# EAGLE design H05 (EAGLE 6.6.0)

## Sheet 1 of 3
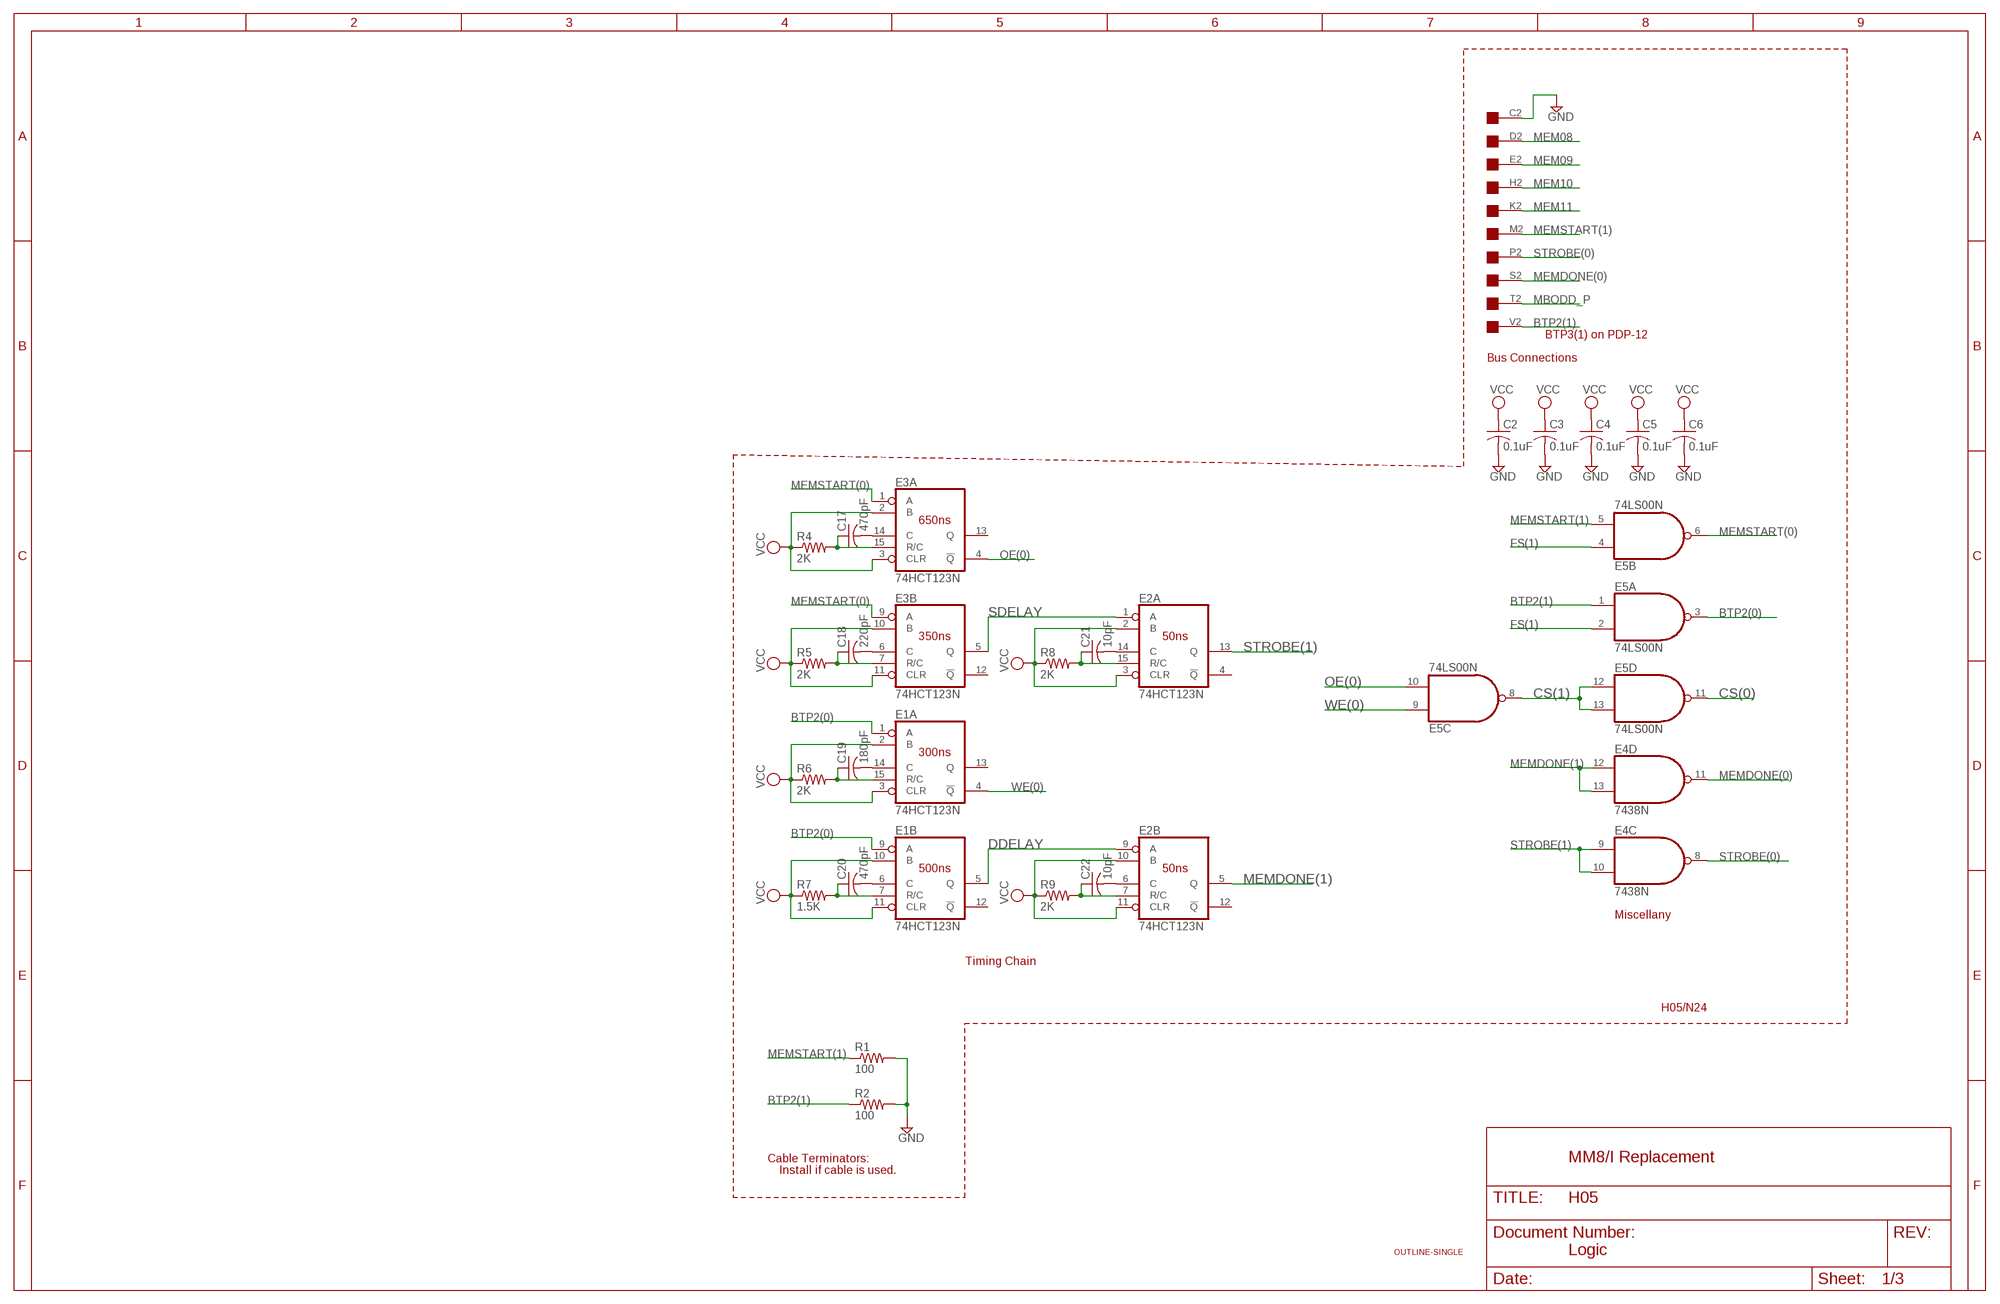
[diagram p0: schematic, sheet 1]

### Parts
C2  0.1uF  C-US050-025X075  [C050-025X075]
C3  0.1uF  C-US050-025X075  [C050-025X075]
C4  0.1uF  C-US050-025X075  [C050-025X075]
C5  0.1uF  C-US050-025X075  [C050-025X075]
C6  0.1uF  C-US050-025X075  [C050-025X075]
C17  470pF  C-US050-025X075  [C050-025X075]
C18  220pF  C-US050-025X075  [C050-025X075]
C19  180pF  C-US050-025X075  [C050-025X075]
C20  470pF  C-US050-025X075  [C050-025X075]
C21  10pF  C-US050-025X075  [C050-025X075]
C22  10pF  C-US050-025X075  [C050-025X075]
E1  74HCT123N  74LS123N  [DIL16]
E2  74HCT123N  74LS123N  [DIL16]
E3  74HCT123N  74LS123N  [DIL16]
E4  7438N  74LS38N  [DIL14]
E5  74LS00N  [DIL14]
H05  EDGE-1  [EDGE-CON1]
R1  100  R-US_0207/10  [0207/10]
R2  100  R-US_0207/10  [0207/10]
R4  2K  R-US_0207/10  [0207/10]
R5  2K  R-US_0207/10  [0207/10]
R6  2K  R-US_0207/10  [0207/10]
R7  1.5K  R-US_0207/10  [0207/10]
R8  2K  R-US_0207/10  [0207/10]
R9  2K  R-US_0207/10  [0207/10]
U$1  OUTLINE-SINGLE  [SINGLE]

### Nets
BTP2(0): E1.1(A:A) E1.9(B:A) E5.3(A:O)
BTP2(1): E5.1(A:I0) H05.V2 R2.1
CS(0): E5.11(D:O) ; also sheet 2
CS(1): E5.8(C:O) E5.12(D:I0) E5.13(D:I1)
DDELAY: E1.5(B:Q) E2.9(B:A)
FS(1): E5.2(A:I1) E5.4(B:I0) ; also sheet 2
GND [supply]: C2.2 C3.2 C4.2 C5.2 C6.2 H05.C2 R1.2 R2.2 ; also sheet 2
MBODD_P: H05.T2 ; also sheet 2
MEM08: H05.D2 ; also sheet 2
MEM09: H05.E2 ; also sheet 2
MEM10: H05.H2 ; also sheet 2
MEM11: H05.K2 ; also sheet 2
MEMDONE(0): E4.11(D:O) H05.S2
MEMDONE(1): E2.5(B:Q) E4.12(D:I0) E4.13(D:I1)
MEMSTART(0): E3.1(A:A) E3.9(B:A) E5.6(B:O)
MEMSTART(1): E5.5(B:I1) H05.M2 R1.1
N$5: C17.1 E3.15(A:R/C) R4.2
N$6: C17.2 E3.14(A:C)
N$7: C18.1 E3.7(B:R/C) R5.2
N$8: C18.2 E3.6(B:C)
N$9: C19.1 E1.15(A:R/C) R6.2
N$10: C19.2 E1.14(A:C)
N$11: C20.1 E1.7(B:R/C) R7.2
N$12: C20.2 E1.6(B:C)
N$13: C21.1 E2.15(A:R/C) R8.2
N$14: C21.2 E2.14(A:C)
N$15: C22.1 E2.7(B:R/C) R9.2
N$16: C22.2 E2.6(B:C)
OE(0): E3.4(A:!Q) E5.10(C:I1) ; also sheet 2
SDELAY: E2.1(A:A) E3.5(B:Q)
STROBE(0): E4.8(C:O) H05.P2
STROBE(1): E2.13(A:Q) E4.9(C:I0) E4.10(C:I1)
VCC [supply]: C2.1 C3.1 C4.1 C5.1 C6.1 E1.2(A:B) E1.3(A:CLR) E1.10(B:B) E1.11(B:CLR) E2.2(A:B) E2.3(A:CLR) E2.10(B:B) E2.11(B:CLR) E3.2(A:B) E3.3(A:CLR) E3.10(B:B) E3.11(B:CLR) R4.1 R5.1 R6.1 R7.1 R8.1 R9.1 ; also sheet 2
WE(0): E1.4(A:!Q) E5.9(C:I0) ; also sheet 2
Unconnected: E1.12(B:!Q) E1.13(A:Q) E2.4(A:!Q) E2.12(B:!Q) E3.12(B:!Q) E3.13(A:Q) H05.A2 H05.B2 H05.F2 H05.J2 H05.L2 H05.N2 H05.R2 H05.U2

### Notes on the sheet
- BTP3(1) on PDP-12
- Bus Connections
- 650ns
- 350ns | 50ns
- 300ns
- 500ns | 50ns
- Miscellany
- Timing Chain
- H05/N24
- Cable Terminators: | MM8/I Replacement
- Install if cable is used.
- Logic

## Sheet 2 of 3
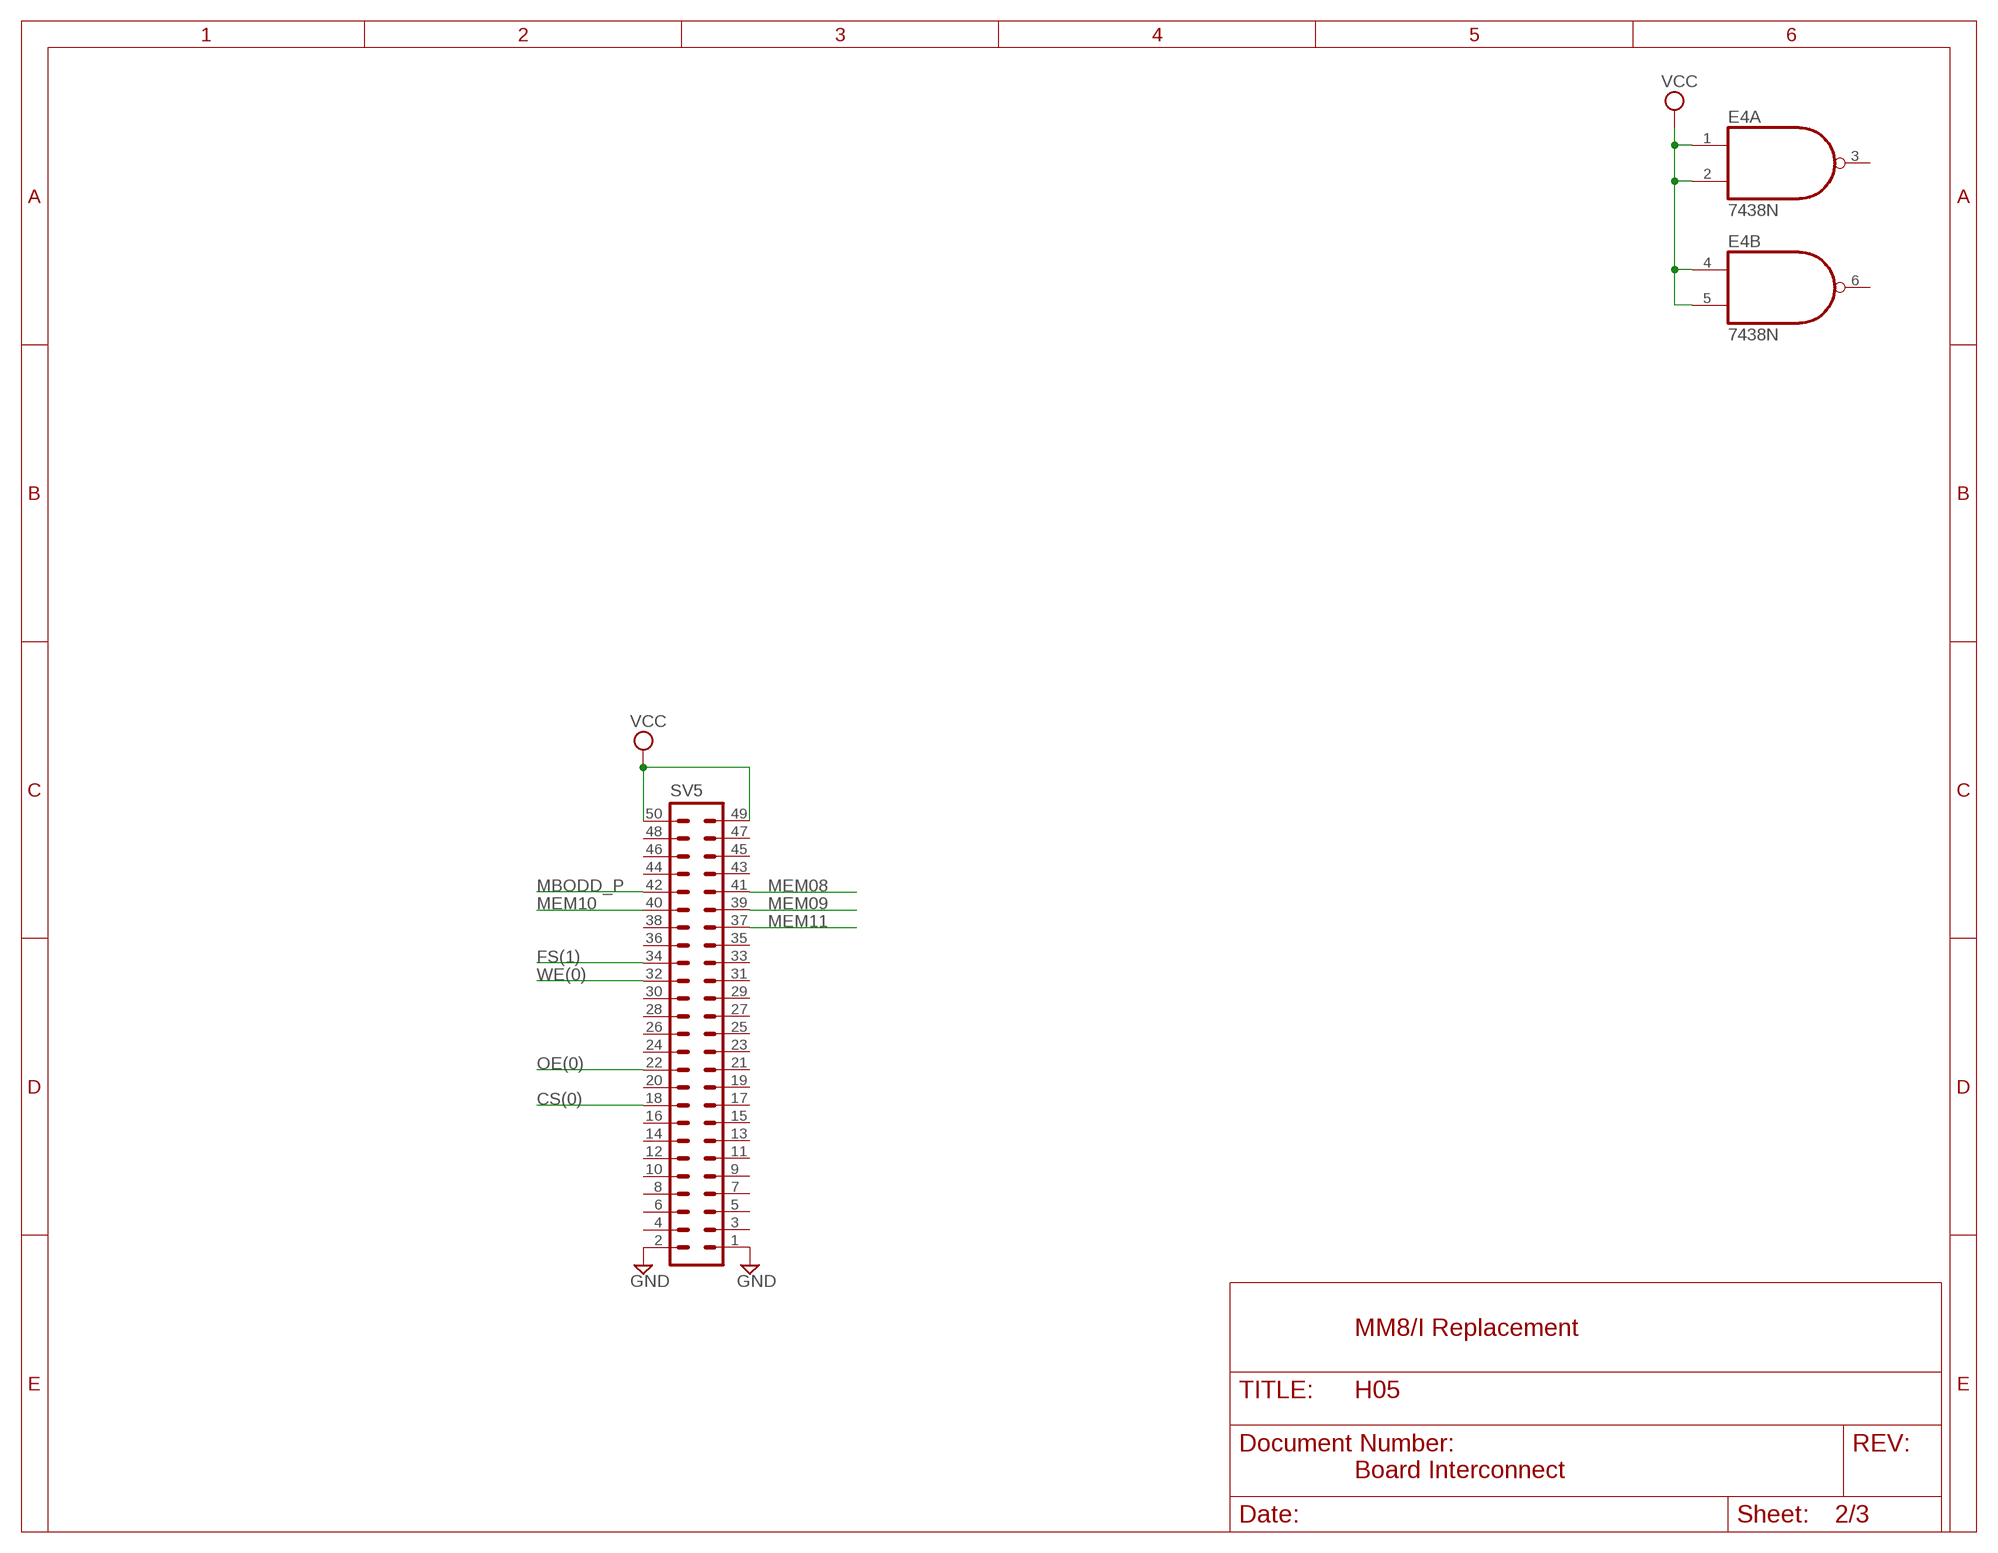
[diagram p1: schematic, sheet 2]

### Parts
SV5  ML50L  [ML50L]

### Nets
CS(0): SV5.18 ; also sheet 1
FS(1): SV5.34 ; also sheet 1
GND [supply]: SV5.1 SV5.2 ; also sheet 1
MBODD_P: SV5.42 ; also sheet 1
MEM08: SV5.41 ; also sheet 1
MEM09: SV5.39 ; also sheet 1
MEM10: SV5.40 ; also sheet 1
MEM11: SV5.37 ; also sheet 1
OE(0): SV5.22 ; also sheet 1
VCC [supply]: E4.1(A:I0) E4.2(A:I1) E4.4(B:I0) E4.5(B:I1) SV5.49 SV5.50 ; also sheet 1
WE(0): SV5.32 ; also sheet 1
Unconnected: E4.3(A:O) E4.6(B:O) SV5.3 SV5.4 SV5.5 SV5.6 SV5.7 SV5.8 SV5.9 SV5.10 SV5.11 SV5.12 SV5.13 SV5.14 SV5.15 SV5.16 SV5.17 SV5.19 SV5.20 SV5.21 SV5.23 SV5.24 SV5.25 SV5.26 SV5.27 SV5.28 SV5.29 SV5.30 SV5.31 SV5.33 SV5.35 SV5.36 SV5.38 SV5.43 SV5.44 SV5.45 SV5.46 SV5.47 SV5.48

### Notes on the sheet
- MM8/I Replacement
- Board Interconnect

## Sheet 3 of 3
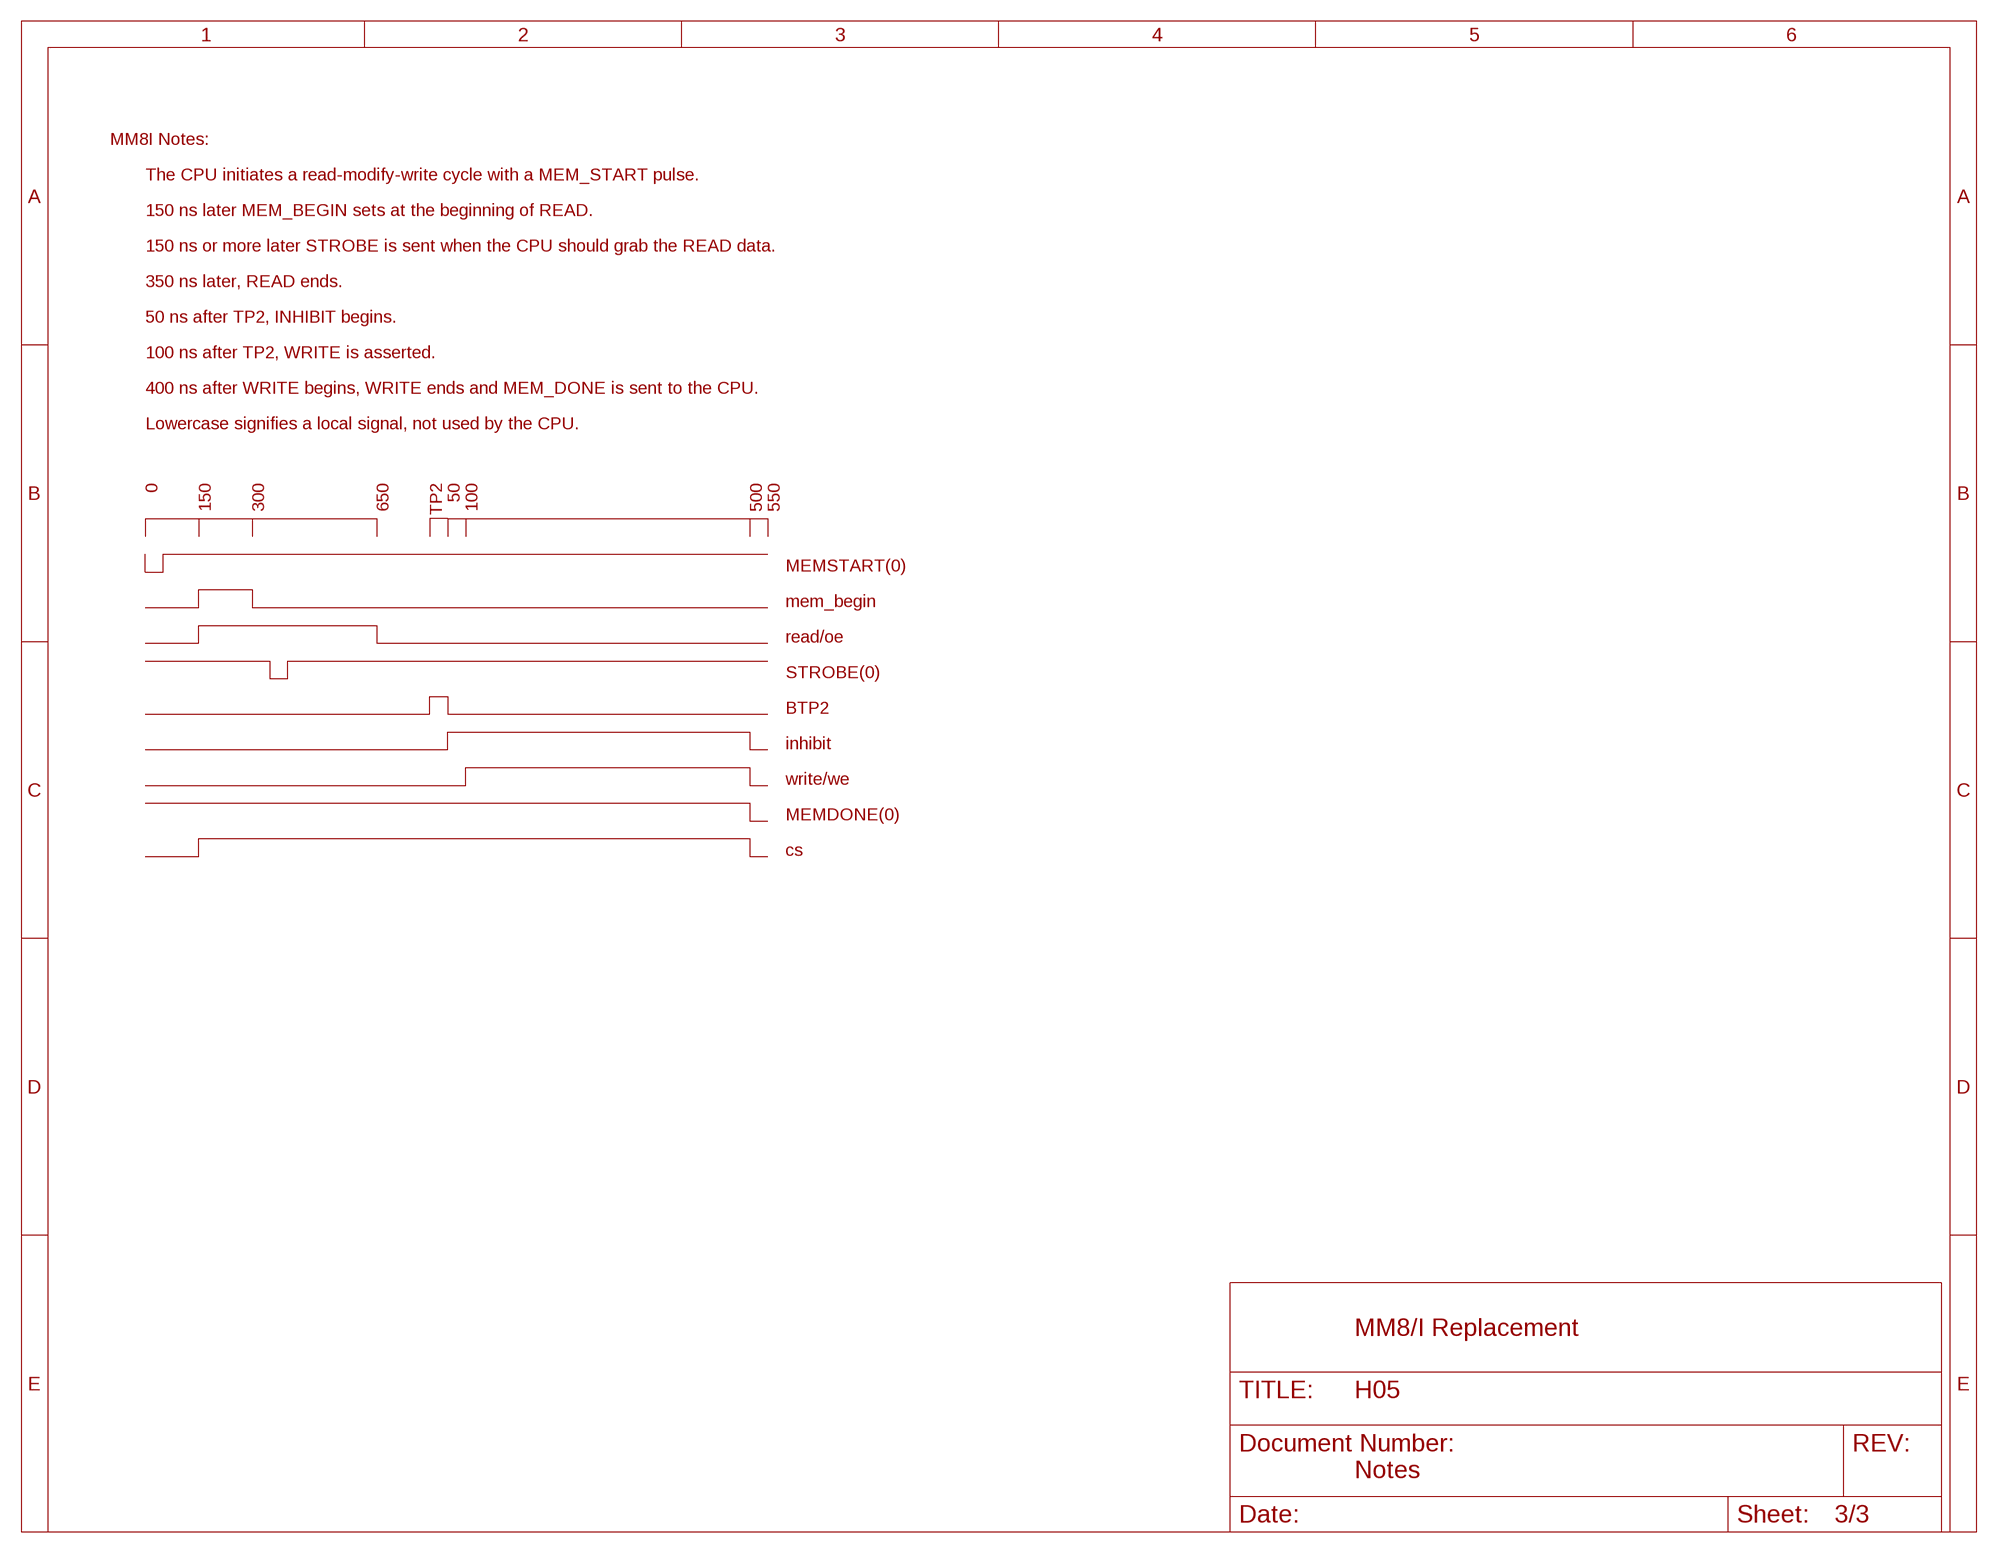
[diagram p2: schematic, sheet 3]

### Notes on the sheet
- MM8I Notes:
- The CPU initiates a read-modify-write cycle with a MEM_START pulse.
- 150 ns later MEM_BEGIN sets at the beginning of READ.
- 150 ns or more later STROBE is sent when the CPU should grab the READ data.
- 350 ns later, READ ends.
- 50 ns after TP2, INHIBIT begins.
- 100 ns after TP2, WRITE is asserted.
- 400 ns after WRITE begins, WRITE ends and MEM_DONE is sent to the CPU.
- Lowercase signifies a local signal, not used by the CPU.
- 0 | 150 | 300 | 650 | TP2 | 50 | 100 | 500 | 550
- MEMSTART(0)
- mem_begin
- read/oe
- STROBE(0)
- BTP2
- inhibit
- write/we
- MEMDONE(0)
- cs
- MM8/I Replacement
- Notes

## Power pins joined to a net without a drawn wire
GND: E1.8(P:GND) E2.8(P:GND) E3.8(P:GND) E4.7(P:GND) E5.7(P:GND)
VCC: E1.16(P:VCC) E2.16(P:VCC) E3.16(P:VCC) E4.14(P:VCC) E5.14(P:VCC)

## Library data of the parts
C2-C6 C17-C22 = rcl:C-US: CAPACITOR, American symbol
E1-E3 = 74xx-us:74*123: Retriggerable monostable MULTIVIBRATOR
E4 = dec-con:74*38: Quad 2-input NAND gate, open collector output
E5 = 74xx-us:74*00: Quad 2-input NAND gate
H05 = dec-con:EDGE-1: Single-Sided DEC Edge Connector -- (side 2)
R1 R2 R4-R9 = rcl:R-US_: RESISTOR, American symbol
SV5 = con-ml:ML50L: HARTING; OC_FARNELL: unknown; OC_NEWARK: unknown
U$1 = dec-con:OUTLINE-*: Board outlines for DEC boards.

## Net classes
1 supply: width 0.711 mm

## Board
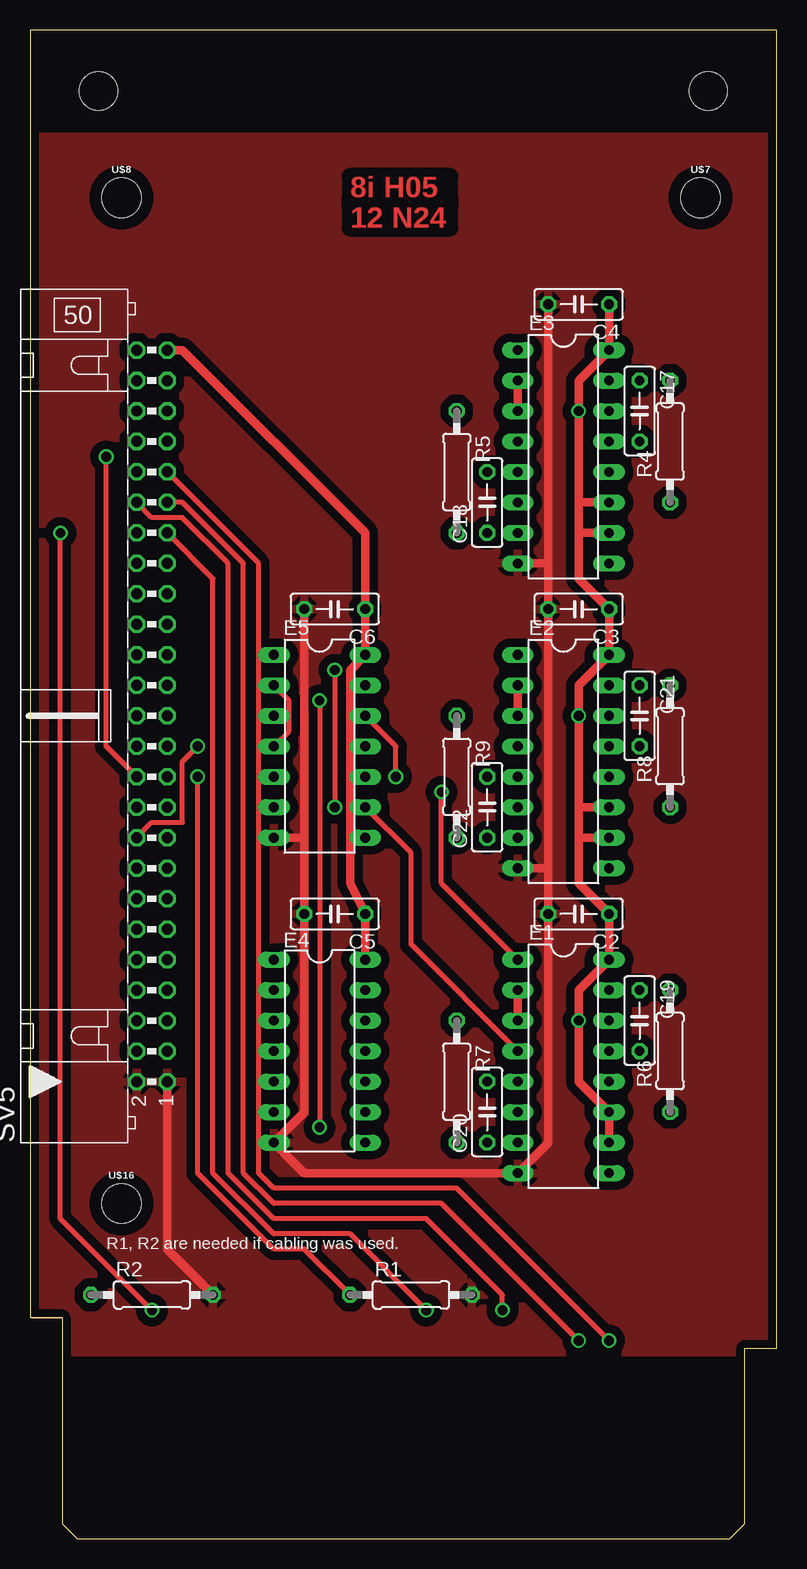
[diagram p3: board, top side]
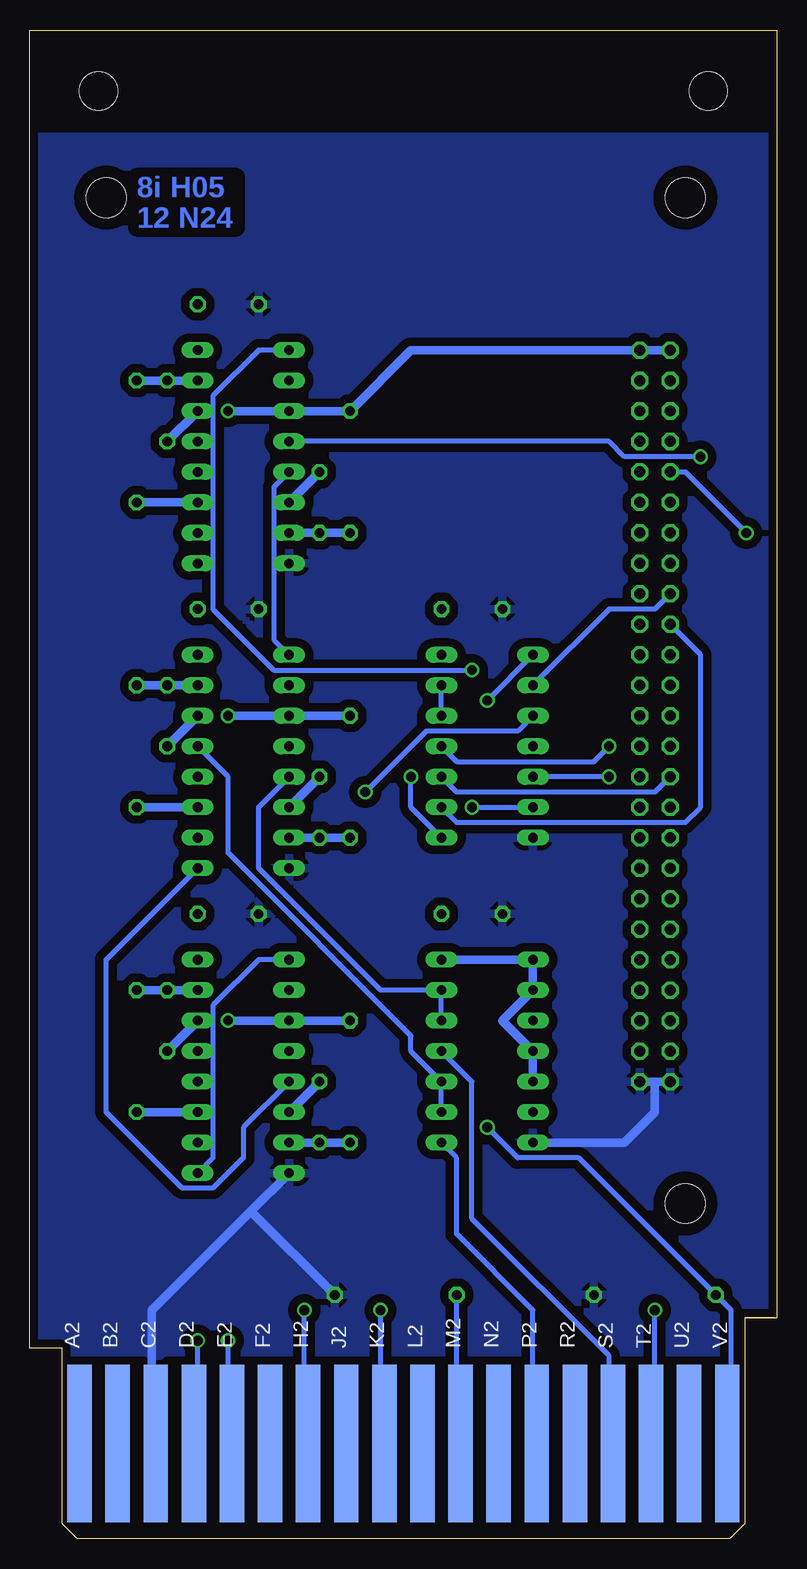
[diagram p4: board, bottom side, seen from below]

Size 62.23 x 125.73 mm. Coordinates in mm from the lower left corner, seen from the top.
Copper layers (1+16): Top 0.035mm / dielectric 1.5mm / Bottom 0.035mm
Design rules "16mils *": minimum track width 16mil, minimum drill 32mil, track to track 15mil, track to pad 10mil, pad to pad 10mil, via to via 10mil, smd to smd 10mil, copper to edge 13mil, drill to drill 10mil, minimum pad ring 10mil, minimum via ring 8mil, stop-mask expansion 0mil, vias tented up to drill 0mil, thermal gap 16mil

### Footprints (pad centres in the part's own frame; a part is rotated, then mirrored left to right if it is on the bottom)
C050-025X075 = drill 0.813 octagon: 1 -2.54,0; 2 2.54,0
DIL16 = drill 0.813 long: 1 -8.89,-3.81; 2 -6.35,-3.81; 3 -3.81,-3.81; 4 -1.27,-3.81; 5 1.27,-3.81; 6 3.81,-3.81; 7 6.35,-3.81; 8 8.89,-3.81; 9 8.89,3.81; 10 6.35,3.81; 11 3.81,3.81; 12 1.27,3.81; 13 -1.27,3.81; 14 -3.81,3.81; 15 -6.35,3.81; 16 -8.89,3.81
DIL14 = drill 0.813 long: 1 -7.62,-3.81; 2 -5.08,-3.81; 3 -2.54,-3.81; 4 0,-3.81; 5 2.54,-3.81; 6 5.08,-3.81; 7 7.62,-3.81; 8 7.62,3.81; 9 5.08,3.81; 10 2.54,3.81; 11 0,3.81; 12 -2.54,3.81; 13 -5.08,3.81; 14 -7.62,3.81
EDGE-CON1 = smd 13.106 x 2.032 bottom: A2 7.938,4.128; B2 7.938,7.303; C2 7.938,10.477; D2 7.938,13.652; E2 7.938,16.828; F2 7.938,20.003; H2 7.938,23.177; J2 7.938,26.352; K2 7.938,29.527; L2 7.938,32.703; M2 7.938,35.877; N2 7.938,39.053; P2 7.938,42.227; R2 7.938,45.403; S2 7.938,48.578; T2 7.938,51.752; U2 7.938,54.928; V2 7.938,58.102
0207/10 = drill 0.813 octagon: 1 -5.08,0; 2 5.08,0
ML50L = drill 0.914 octagon: 1 -30.48,-1.27; 2 -30.48,1.27; 3 -27.94,-1.27; 4 -27.94,1.27; 5 -25.4,-1.27; 6 -25.4,1.27; 7 -22.86,-1.27; 8 -22.86,1.27; 9 -20.32,-1.27; 10 -20.32,1.27; 11 -17.78,-1.27; 12 -17.78,1.27; 13 -15.24,-1.27; 14 -15.24,1.27; 15 -12.7,-1.27; 16 -12.7,1.27; 17 -10.16,-1.27; 18 -10.16,1.27; 19 -7.62,-1.27; 20 -7.62,1.27; 21 -5.08,-1.27; 22 -5.08,1.27; 23 -2.54,-1.27; 24 -2.54,1.27; 25 0,-1.27; 26 0,1.27; 27 2.54,-1.27; 28 2.54,1.27; 29 5.08,-1.27; 30 5.08,1.27; 31 7.62,-1.27; 32 7.62,1.27; 33 10.16,-1.27; 34 10.16,1.27; 35 12.7,-1.27; 36 12.7,1.27; 37 15.24,-1.27; 38 15.24,1.27; 39 17.78,-1.27; 40 17.78,1.27; 41 20.32,-1.27; 42 20.32,1.27; 43 22.86,-1.27; 44 22.86,1.27; 45 25.4,-1.27; 46 25.4,1.27; 47 27.94,-1.27; 48 27.94,1.27; 49 30.48,-1.27; 50 30.48,1.27
SINGLE = hole 3.175: 120.65,56.515; 120.65,5.715
STAND-OFF = hole 3.302: 0,0

### Placement (x,y rotation side)
C2  45.72,52.07 180 top
C3  45.72,77.47 180 top
C4  45.72,102.87 180 top
C5  25.4,52.07 180 top
C6  25.4,77.47 180 top
C17  50.8,93.98 270 top
C18  38.1,86.36 90 top
C19  50.8,43.18 270 top
C20  38.1,35.56 90 top
C21  50.8,68.58 270 top
C22  38.1,60.96 90 top
E1  44.45,39.37 270 top
E2  44.45,64.77 270 top
E3  44.45,90.17 270 top
E4  24.13,40.64 270 top
E5  24.13,66.04 270 top
H05  62.23,0 90 top
R1  31.75,20.32 0 top
R2  10.16,20.32 0 top
R4  53.34,91.44 90 top
R5  35.56,88.9 270 top
R6  53.34,40.64 90 top
R7  35.56,38.1 270 top
R8  53.34,66.04 90 top
R9  35.56,63.5 270 top
SV5  10.16,68.58 90 top
U$1  62.23,0 90 top
U$7  [STAND-OFF]  55.88,111.76 0 top
U$8  [STAND-OFF]  7.62,111.76 0 top
U$16  [STAND-OFF]  7.62,27.94 0 top

### Tracks (layer width: path | path; a pad name or v marks a point on that pad's centre or on a via)
BTP2(0)  (via drill 0.81)
  Top 0.406: v34.29,62.23 34.29,54.61 E1.1
  Bottom 0.406: E5.3 21.59,67.31 29.21,67.31 v34.29,62.23 | E1.1 43.18,48.26 46.99,44.45 46.99,31.75 E1.9
BTP2(1)  (via drill 0.81)
  Top 0.406: v24.13,69.85 v24.13,34.29
  Bottom 0.406: H05.V2 4.13,8.57 3.81,8.89 3.81,19.05 R2.1 16.51,31.75 21.59,31.75 v24.13,34.29 | E5.1 v24.13,69.85
CS(0)  (via drill 0.81)
  Top 0.406: SV5.18 10.16,59.69 12.7,59.69 12.7,64.77 v13.97,66.04
  Bottom 0.406: E5.11 26.67,64.77 15.24,64.77 v13.97,66.04
CS(1)  (via drill 0.81)
  Top 0.406: v30.48,63.5 30.48,66.04 E5.12
  Bottom 0.406: E5.8 30.48,60.96 v30.48,63.5 | E5.12 E5.13
DDELAY
  Bottom 0.406: E1.5 44.45,34.29 44.45,31.75 46.99,29.21 49.53,29.21 55.88,35.56 55.88,48.26 E2.9
FS(1)
  Top 0.406: E5.4 21.59,67.31 21.59,69.85 E5.2
  Bottom 0.406: SV5.34 10.16,77.47 13.97,77.47 E5.2
GND
  Top 0.711: E5.7 22.86,58.42 | 22.86,58.42 C5.2 22.86,35.56 E4.7 22.86,30.48 E1.8 43.18,33.02 C2.2 43.18,55.88 | C6.2 22.86,58.42 | R2.2 11.43,24.13 SV5.1 | 43.18,55.88 C3.2 43.18,81.28 | 43.18,81.28 C4.2 | E2.8 43.18,55.88 | E3.8 43.18,81.28
  Bottom 0.711: H05.C2 51.75,8.57 52.07,8.89 52.07,19.05 43.81,27.31 | SV5.2 10.16,38.1 | SV5.1 10.16,38.1 | 10.16,38.1 10.16,35.56 12.7,33.02 E4.7 | E1.8 43.81,27.31 | R1.2 43.81,27.31
  pour Bottom (isolate 0.711): 0,15.24 62.23,15.24 62.23,116.84 0,116.84
  pour Top (isolate 0.711): 0,15.24 62.23,15.24 62.23,116.84 0,116.84
MBODD_P  (via drill 0.81)
  Top 0.406: v2.54,83.82 2.54,26.67 v10.16,19.05
  Bottom 0.406: H05.T2 10.48,8.57 10.16,8.89 v10.16,19.05 | SV5.42 7.62,88.9 v2.54,83.82
MEM08  (via drill 0.81)
  Top 0.406: SV5.41 19.05,81.28 19.05,30.48 20.32,29.21 35.56,29.21 v48.26,16.51
  Bottom 0.406: H05.D2 48.58,8.57 48.26,8.89 v48.26,16.51
MEM09  (via drill 0.81)
  Top 0.406: SV5.39 12.7,86.36 17.78,81.28 17.78,30.48 20.32,27.94 34.29,27.94 v45.72,16.51
  Bottom 0.406: H05.E2 45.4,8.57 45.72,8.89 v45.72,16.51
MEM10  (via drill 0.81)
  Top 0.406: SV5.40 10.16,85.09 12.7,85.09 16.51,81.28 16.51,30.48 20.32,26.67 33.02,26.67 39.37,20.32 v39.37,19.05
  Bottom 0.406: H05.H2 39.05,8.57 39.37,8.89 v39.37,19.05
MEM11  (via drill 0.81)
  Top 0.406: SV5.37 15.24,80.01 15.24,30.48 20.32,25.4 26.67,25.4 v33.02,19.05
  Bottom 0.406: H05.K2 32.7,8.57 33.02,8.89 v33.02,19.05
MEMDONE(0)
  Bottom 0.406: H05.S2 13.65,8.57 13.97,8.89 13.97,15.24 25.4,26.67 25.4,38.1 E4.11
MEMDONE(1)
  Bottom 0.406: E4.12 E4.13 33.02,45.72 43.18,55.88 43.18,60.96 E2.5
MEMSTART(0)  (via drill 0.81)
  Top 0.406: v25.4,72.39 v25.4,60.96
  Bottom 0.406: E3.1 43.18,99.06 46.99,95.25 46.99,81.28 | 46.99,81.28 E3.9 | 46.99,81.28 46.99,77.47 41.91,72.39 v25.4,72.39 | v25.4,60.96 E5.6
MEMSTART(1)  (via drill 0.81)
  Top 0.406: R1.1 22.86,24.13 20.32,24.13 13.97,30.48 v13.97,63.5
  Bottom 0.406: H05.M2 26.35,8.57 26.67,8.89 R1.1 | v13.97,63.5 E5.5
N$5
  Bottom 0.711: E3.15 C17.1 R4.2
N$6
  Bottom 0.711: E3.14 C17.2
N$7
  Bottom 0.711: R5.2 C18.1 E3.7
N$8
  Bottom 0.711: C18.2 E3.6
N$9
  Bottom 0.711: E1.15 C19.1 R6.2
N$10
  Bottom 0.711: C19.2 E1.14
N$11
  Bottom 0.711: E1.7 C20.1 R7.2
N$12
  Bottom 0.711: C20.2 E1.6
N$13
  Bottom 0.711: E2.15 C21.1 R8.2
N$14
  Bottom 0.711: E2.14 C21.2
N$15
  Bottom 0.711: E2.7 C22.1 R9.2
N$16
  Bottom 0.711: C22.2 E2.6
OE(0)  (via drill 0.81)
  Top 0.406: SV5.22 6.35,66.04 v6.35,90.17
  Bottom 0.406: v6.35,90.17 12.7,90.17 13.97,91.44 E3.4 | SV5.22 10.16,62.23 26.67,62.23 E5.10
SDELAY
  Bottom 0.406: E3.5 41.91,87.63 41.91,74.93 E2.1
STROBE(0)
  Bottom 0.406: H05.P2 20.32,8.26 20.32,19.05 26.67,25.4 26.67,31.75 E4.8
STROBE(1)
  Bottom 0.406: E4.9 E4.10 30.48,40.64 30.48,41.91 45.72,57.15 45.72,63.5 E2.13
VCC  (via drill 0.81)
  Top 0.711: E4.14 C5.1 26.67,54.61 26.67,72.39 E5.14 C6.1 27.94,83.82 12.7,99.06 SV5.49 | 45.72,58.42 45.72,54.61 C2.1 E1.16 45.72,45.72 v45.72,43.18 45.72,38.1 E1.11 E1.10 | 45.72,58.42 45.72,60.96 | 45.72,60.96 E2.11 | 45.72,60.96 v45.72,68.58 45.72,71.12 E2.16 C3.1 45.72,80.01 45.72,83.82 | 45.72,83.82 45.72,86.36 | 45.72,86.36 E3.11 | 45.72,86.36 v45.72,93.98 45.72,96.52 E3.16 C4.1 | E1.3 E1.2 | E2.3 E2.2 | E2.10 45.72,58.42 | E3.10 45.72,83.82 | E3.3 E3.2
  Bottom 0.711: SV5.50 SV5.49 30.48,99.06 R5.1 E3.3 v45.72,93.98 | R9.1 E2.3 v45.72,68.58 | R7.1 E1.3 v45.72,43.18 | E3.11 R4.1 | E2.11 R8.1 | R6.1 E1.11 | E4.14 E4.1 E4.2 22.86,43.18 E4.4 E4.5
WE(0)
  Top 0.406: E1.4 31.75,49.53 31.75,57.15 E5.9
  Bottom 0.406: SV5.32 6.35,73.66 6.35,60.96 7.62,59.69 26.67,59.69 E5.9

### Text on the board
Top: 8i H05 | 12 N24
Bottom: 8i H05 | 12 N24
tPlace: R1, R2 are needed if cabling was used.
tValues: 8i H05 | 12 N24